# Altium project ESP32-DCU-Rev1.PrjPcb (part 2 of 2)

## Sheet TCA9548A.SchDoc
size B
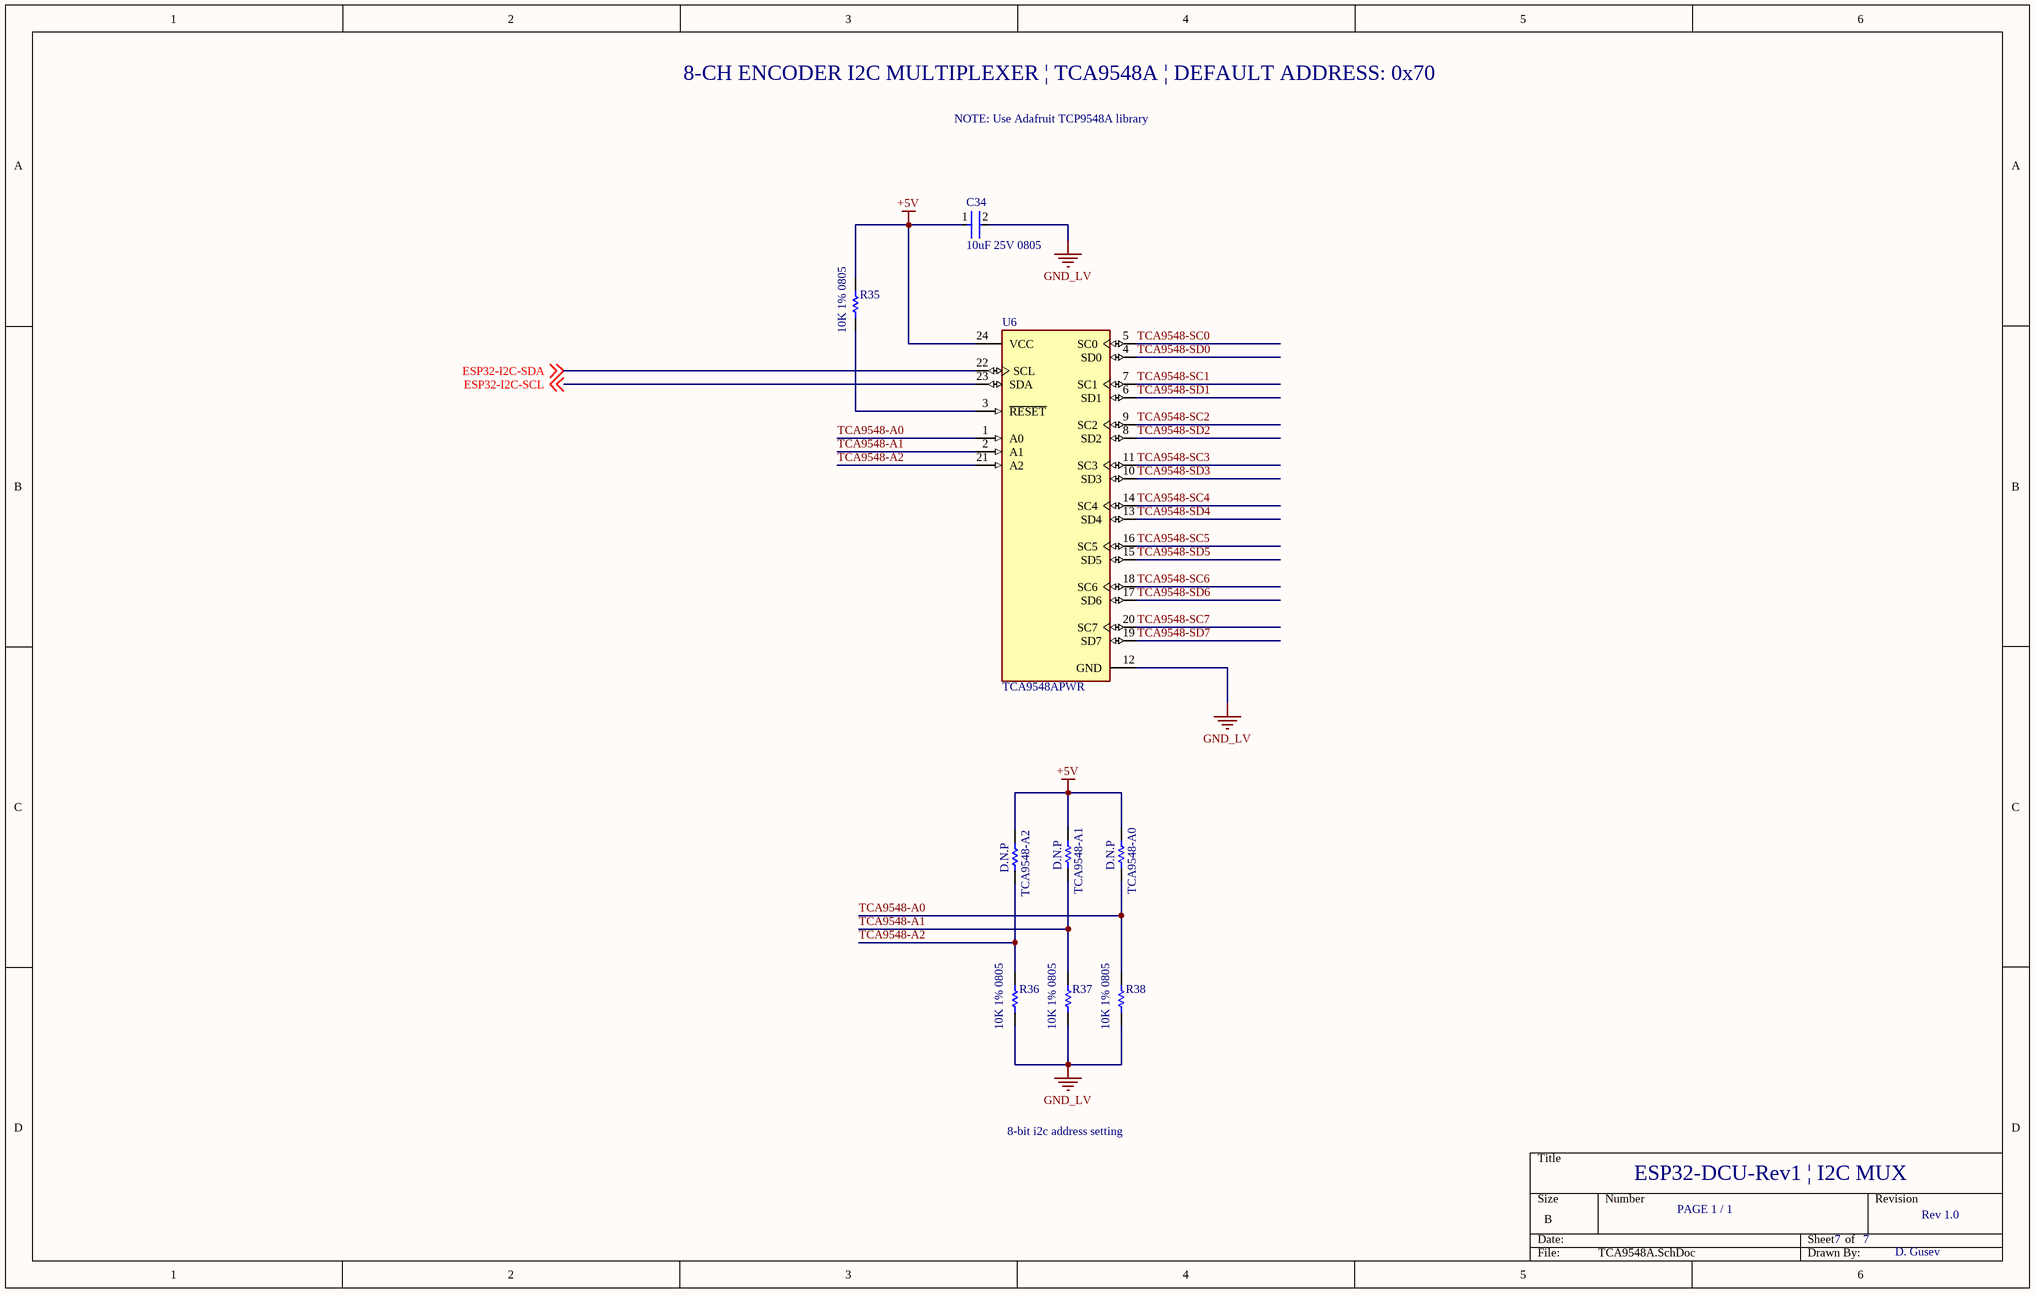
[diagram p5: TCA9548A.SchDoc]

### Parts
C34  10uF 25V 0805  [FP-GRM21B-0_15-IPC_B]
R35  10K 1% 0805  [RESC2013X60X35ML10T20]
R36  10K 1% 0805  [RESC2013X60X35ML10T20]
R37  10K 1% 0805  [RESC2013X60X35ML10T20]
R38  10K 1% 0805  [RESC2013X60X35ML10T20]
TCA9548-A0  D.N.P  [RESC2013X60X35LL10T20]
TCA9548-A1  D.N.P  [RESC2013X60X35LL10T20]
TCA9548-A2  D.N.P  [RESC2013X60X35LL10T20]
U6  TCA9548APWR  [FP-PW0024A-MFG]

### Nets
+5V: C34.1 R35.2 TCA9548-A0.2 TCA9548-A1.2 TCA9548-A2.2 U6.24(VCC)
GND_LV: C34.2 R36.2 R37.2 R38.2 U6.12(GND)
ESP32-I2C-SCL: U6.23(SDA) ; off-sheet ESP32-I2C-SCL  [project net GPIO22 / SCL]
ESP32-I2C-SDA: U6.22(SCL) ; off-sheet ESP32-I2C-SDA  [project net GPIO21 / SDA]
TCA9548-A0: R38.1 TCA9548-A0.1 U6.1(A0)
TCA9548-A1: R37.1 TCA9548-A1.1 U6.2(A1)
TCA9548-A2: R36.1 TCA9548-A2.1 U6.21(A2)
TCA9548-SC0: U6.5(SC0)
TCA9548-SC1: U6.7(SC1)
TCA9548-SC2: U6.9(SC2)
TCA9548-SC3: U6.11(SC3)
TCA9548-SC4: U6.14(SC4)
TCA9548-SC5: U6.16(SC5)
TCA9548-SC6: U6.18(SC6)
TCA9548-SC7: U6.20(SC7)
TCA9548-SD0: U6.4(SD0)
TCA9548-SD1: U6.6(SD1)
TCA9548-SD2: U6.8(SD2)
TCA9548-SD3: U6.10(SD3)
TCA9548-SD4: U6.13(SD4)
TCA9548-SD5: U6.15(SD5)
TCA9548-SD6: U6.17(SD6)
TCA9548-SD7: U6.19(SD7)
NetR35_1: R35.1 U6.3(~{RESET})

### Notes on the sheet
- 8-CH ENCODER I2C MULTIPLEXER | TCA9548A | DEFAULT ADDRESS: 0x70
- NOTE: Use Adafruit TCP9548A library
- 8-bit i2c address setting
- ESP32-DCU-Rev1 | I2C MUX
- PAGE 1 / 1
- 7
- Rev 1.0
- D. Gusev

### Library data of the parts
C34 = CMP-2007-03541-2: Chip Multilayer Ceramic Capacitors for General Purpose, 0805, 10uF, X5R, 15%, 10%, 25V; Length: 2mm; Depth: 1.25mm; Termination: SMD/SMT; Voltage: 25V; Height: 1.25mm; Material: Ceramic; Thickness: 0.053inch; Radiation Hardening: No; Min Operating Temperature: -55°C; Width: 0.049inch; Package Quantity: 1; Mount: Surface Mount; Dielectric: X5R; Packaging: Tape and Reel; Capacitance: 10uF; Voltage Rating (DC): 25V; Lead Free: Lead Free; Max Operating Temperature: 85°C; Case Code (Imperial): 0805; Case/Package: 0805; Tolerance: 10%; Voltage Rating: 25V; Case Code (Metric): 2012
R35-R38 = CMP-2000-05025-1: Chip Resistor, 10 KOhm, +/- 5%, 0.125 W, -55 to 155 degC, 0805 (2012 Metric), RoHS, Tape and Reel; Manufacturer: Yageo; Resistor Element Type: ThickFilm; Voltage Rating: 150V; Product Range: RCSeries; SVHC: ToBeAdvised; Resistor Case Style: 0805[2012Metric]; Temperature Coefficient: ±100ppm/degC; Power Rating: 250mW; Resistance: 10kohm; Automotive Qualification Standard: -; Datasheet Version: REV. 2, 09/2004; Packaging: CutTape; Resistance Tolerance: ±5%; MSL: MSL1-Unlimited; Manufacturer URL: http://www.yageo.com/; Datasheet URL: http://www.yageo.ru/pdf/RC0805.pdf; Package Description: 2-Pin Surface Mounted Device, Body 2 x 1.25 mm; Package Reference: 805
TCA9548-A0-TCA9548-A2 = CMP-1659-00014-4: as VSPI-CS-5 on sheet ESP32; REACH SVHC: No SVHC; Mounting Technology: Surface Mount; RoHSCompliant: true; Packaging: Tape and Reel; ComponentLink2URL: http://www.yageo.com/documents/recent/PYu-RC_Group_51_RoHS_L_04.pdf; Pins: 2; Package Quantity: 5000; DatasheetVersion: Rev. 4, 02/2016; Mount: Surface Mount; Max Operating Temperature: 155 degC; PackageDescription: 2-Pin Surface Mounted Device, Body 2 x 1.25 mm; PackageReference: 0805; Length: 2 mm; Min Operating Temperature: -55 degC; ComponentLink1URL: http://www.yageo.com/; Height: 0.5 mm; ComponentLink1Description: Manufacturer URL; ComponentLink2Description: Datasheet
U6 = CMP-04892-000002-1: IC I2C SW 8CH W/RESET 24TSSOP; Manufacturer: Texas Instruments; Number Of Circuits: 1; Mux Demux Ratio: 1:8; Nominal Supply Current: 2-50uA; Interface: I2C,SMBus; Min Supply Voltage: 1.65V; Standoff Height: 0.05mm; Description: Bus Switch 1 x 8:1 24-TSSOP; Max Supply Voltage: 5.5V; Device Class L2: Interface ICs; ComponentLink2Description: Datasheet; Ipc Land Pattern Name: SOP65P640X120-24; Category: IC; Device Class L1: Integrated Circuits (ICs); Manufacturer Part Number: TCA9548APWR; RoHS: TRUE; Temperature Range High: +85°C; Digikey Description: IC I2C SW 8CH W/RESET 24TSSOP; Temperature Range Low: -40°C; Lead Free: Yes; Package: PW0024A; ComponentLink2URL: http://www.ti.com/lit/ds/symlink/tca9548a.pdf; Device Class L3: Multiplexers; Ambient Temperature Range Low: -40°C; Mouser Description: Low-Voltage 8-Channel I2C Switch With Reset 24-TSSOP -40 to 85; Temperature: -40°C to +85°C; Octopart: https://octopart.com/tca9548apwr-texas+instruments-22266789; Ambient Temperature Range High: +85°C; Automotive: No; Height: 1.2mm

## Sheet DCU1.SchDoc
size B
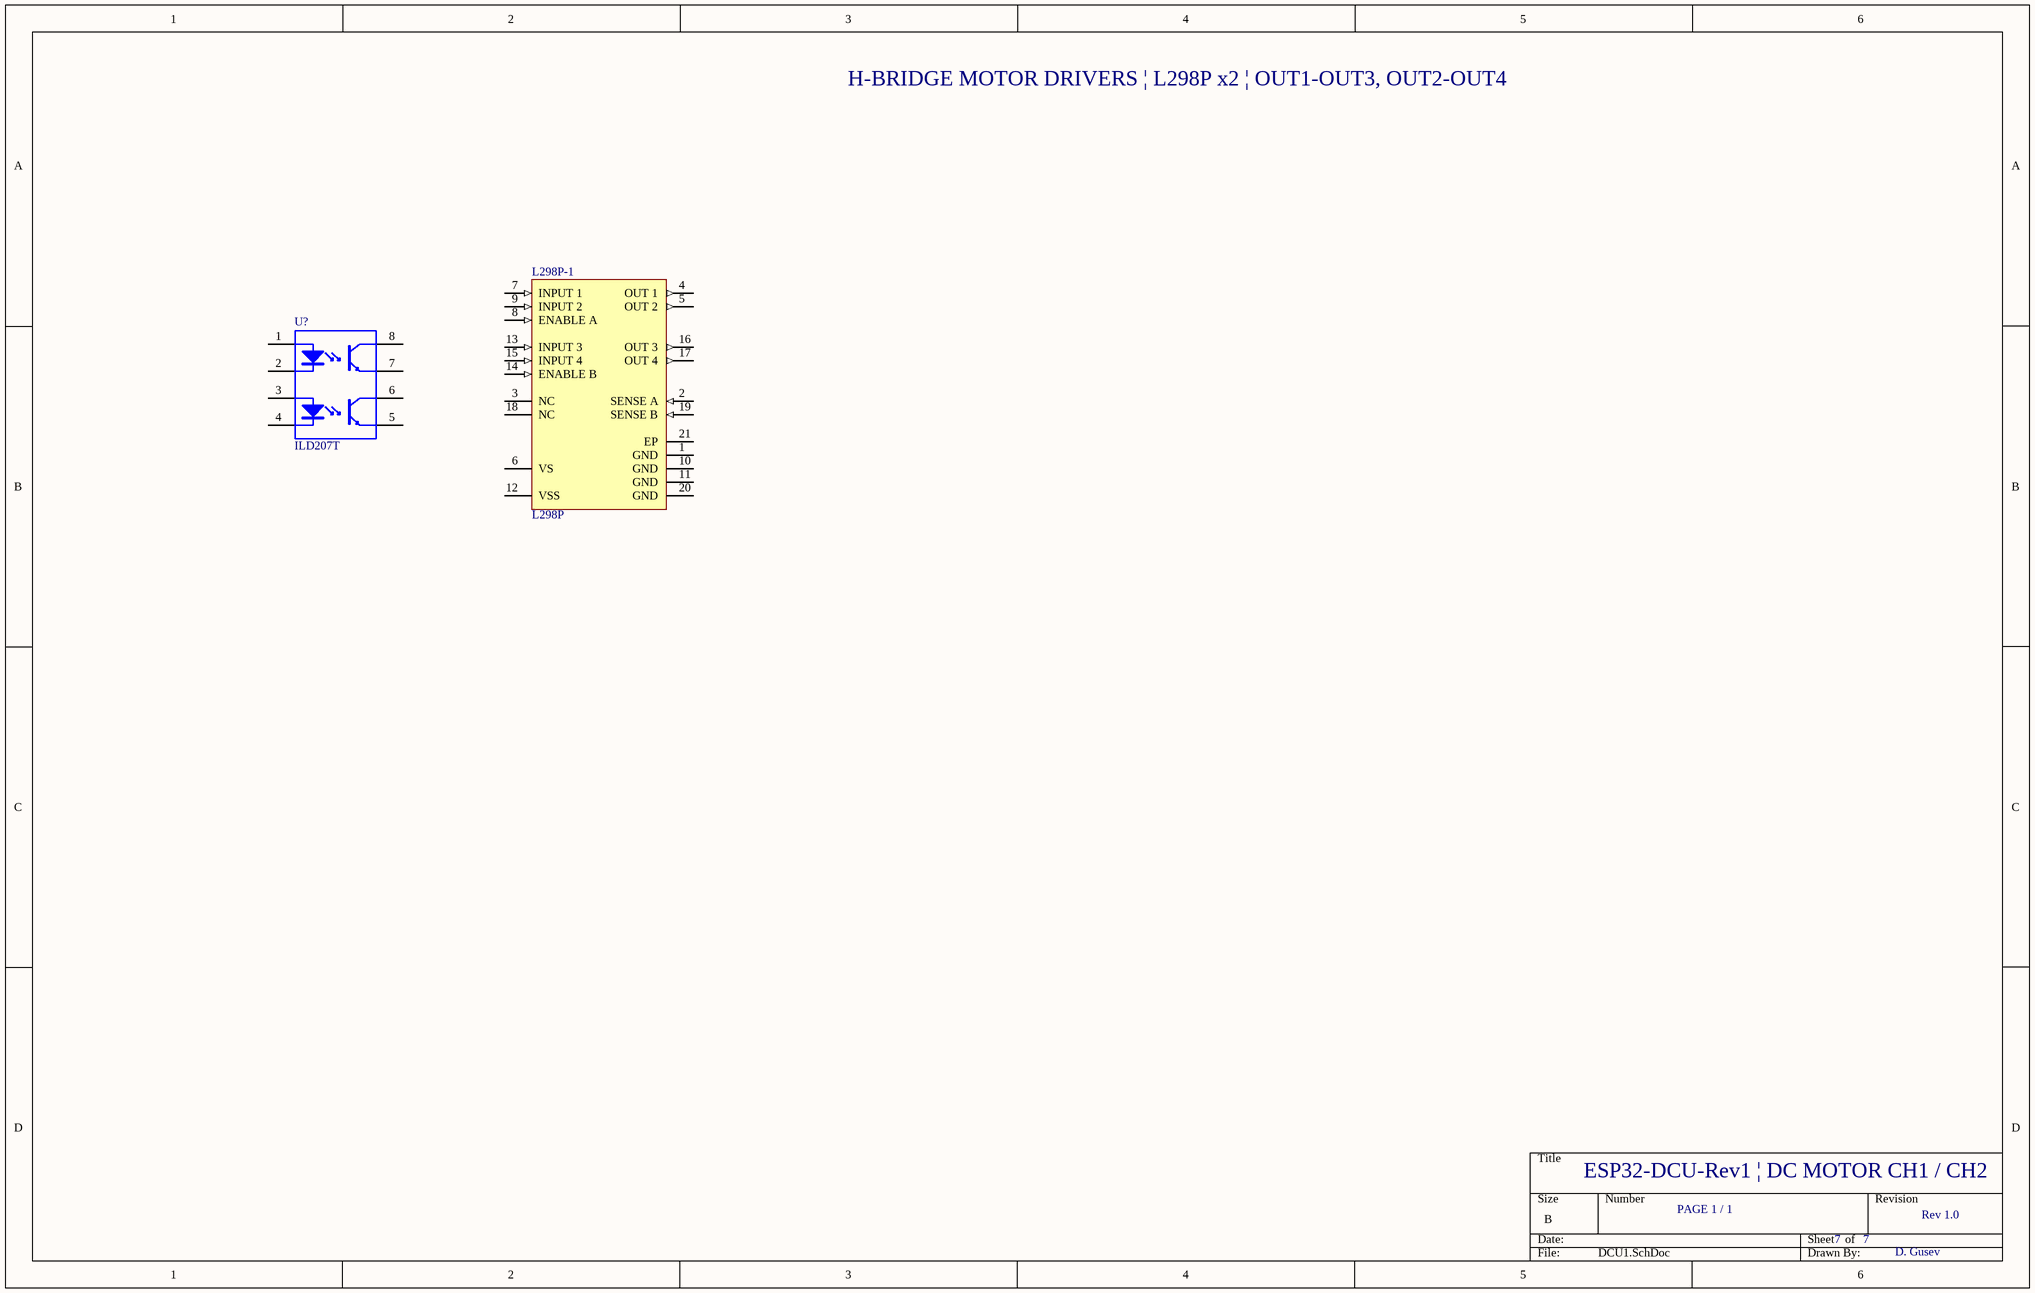
[diagram p6: DCU1.SchDoc]

### Parts
L298P-1  L298P  [STM-PowerSO20_M]
U?  ILD207T  [VISH-SOIC-8_C_V]

### Nets

Not connected (* = marked no-connect by the designer): L298P-1 1(GND) 2(SENSE_A) 3(NC) 4(OUT_1) 5(OUT_2) 6(VS) 7(INPUT_1) 8(ENABLE_A) 9(INPUT_2) 10(GND) 11(GND) 12(VSS) 13(INPUT_3) 14(ENABLE_B) 15(INPUT_4) 16(OUT_3) 17(OUT_4) 18(NC) 19(SENSE_B) 20(GND) 21(EP); U? 1(A) 2(K) 3(A) 4(K) 5(E) 6(C) 7(E) 8(C)

### Notes on the sheet
- H-BRIDGE MOTOR DRIVERS | L298P x2 | OUT1-OUT3, OUT2-OUT4
- ESP32-DCU-Rev1 | DC MOTOR CH1 / CH2
- PAGE 1 / 1
- 7
- Rev 1.0
- D. Gusev

### Library data of the parts
L298P-1 = CMP-2100-03649-1: Dual Full-Bridge Driver, 4.5 to 7 V, -25 to 130 degC, 20-Pin SOIC, RoHS, Tube; Manufacturer: STMicroelectronics; Output Current: 2A; Collector Emitter Voltage (VCEO): 46V; Min Supply Voltage: 4.8V; Max Collector Current: 3A; Supply Voltage: 42V; Number of Channels: 2; Operating Supply Current: 13mA; Packaging: Rail/Tube; Package Reference: PowerSO20; Width: 11.1mm; Radiation Hardening: No; Height: 3.3mm; Lead Free: LeadFree; Datasheet Version: 36526.0; Datasheet URL: http://www.st.com/content/ccc/resource/technical/document/datasheet/82/cc/3f/39/0a/29/4d/f0/CD00000240.pdf/files/CD00000240.pdf/jcr:content/translations/en.CD00000240.pdf; RoHSCompliant: true; Max Supply Voltage: 46V; Output Current per Channel: 2A; Package Description: 20-Pin Small Outline Integrated Circuits, Body 15.9 x 11 mm, Pitch 1.27 mm; Case/Package: SOIC; Min Operating Temperature: -25degC; Number of Pins: 20; Length: 16mm; Max Output Current: 3A; Package Quantity: 31; Max Operating Temperature: 130degC; Mount: SurfaceMount; Manufacturer URL: http://www.st.com/
U? = CMP-2000-06453-1: Optocoupler, Phototransistor Output, Dual Channel, 4000 VRMS, -55 to 100 degC, 8-Pin SOIC, RoHS, Tape and Reel; Manufacturer: Vishay; Voltage - Output (Max): 70V; Vce Saturation (Max): 400mV; Number of Channels: 2; Voltage - Forward (Vf) (Typ): 1.2V; EDA / CAD Models: DownloadfromAcceleratedDesigns; Current Transfer Ratio (Min): 100%@10mA; Current Transfer Ratio (Max): 200%@10mA; Input Type: DC; Current - DC Forward (If) (Max): 30mA; Rise / Fall Time (Typ): 3µs,4.7µs; Turn On / Turn Off Time (Typ): 6µs,5µs; Catalog Drawings: OptocouplerCircuit; Other Names: 751-1310-1ILD207TGICTILD207TGICT-ND; Online Catalog: ILD205T,206T,207T,211T,213T,217TSeries; Mounting Type: SurfaceMount; Package Description: 8-Pin Small Outline Integrated Circuit, Body 5.84 x 3.91 mm, Pitch 1.27 mm; Output Type: Transistor; Package / Case: 8-SOIC(0.154",3.90mmWidth); Category: Isolators; Operating Temperature: -55°C~100°C; Family: Optoisolators-Transistor,PhotovoltaicOutput; Package Reference: SOIC-8; Voltage - Isolation: 4000Vrms; Supplier Device Package: 8-SOIC; Standard Package: 1; Manufacturer URL: http://www.vishay.com/; Series: -; Packaging: CutTape(CT); Datasheet Version: Rev. 2.1, 10/2015; Datasheet URL: http://www.vishay.com/docs/83647/ild205t.pdf; Mounting Technology: SurfaceMount; Current - Output / Channel: -

## Sheet RELAYS.SchDoc
size B
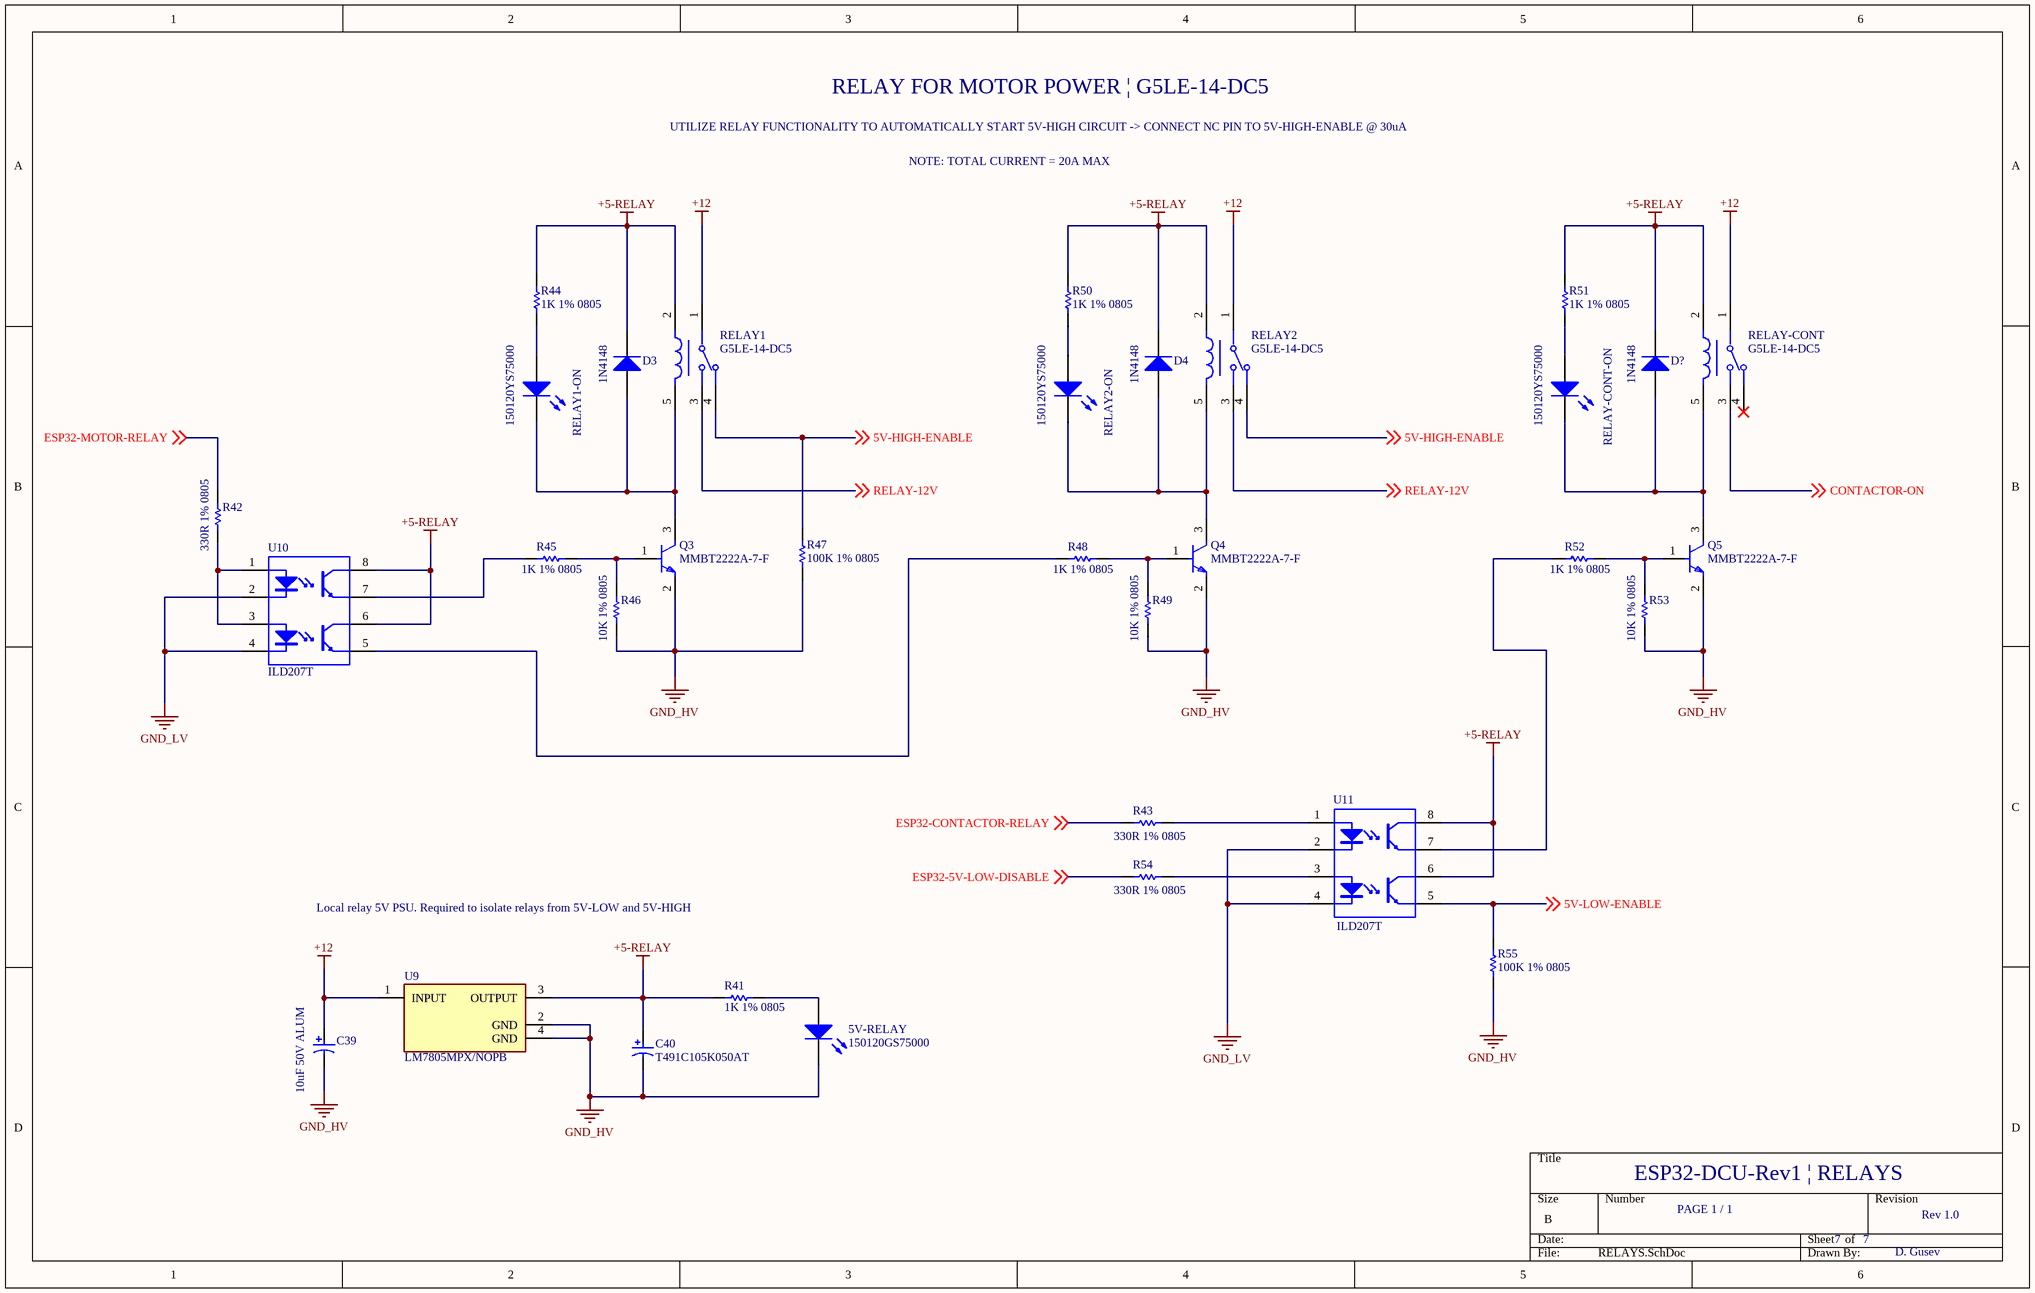
[diagram p7: RELAYS.SchDoc]

### Parts
5V-RELAY  150120GS75000  [1206_A]
C39  10uF 50V ALUM  [PNSC-FK-V-D_V]
C40  T491C105K050AT  [KEMT-T491-C_L]
D3  1N4148  [NXP-SOD27-2_V]
D4  1N4148  [NXP-SOD27-2_V]
D?  1N4148  [NXP-SOD27-2_V]
Q3  MMBT2222A-7-F  [FP-SOT23-IPC_A]
Q4  MMBT2222A-7-F  [FP-SOT23-IPC_A]
Q5  MMBT2222A-7-F  [FP-SOT23-IPC_A]
R41  1K 1% 0805  [RESC2013X60X40ML20T25]
R42  330R 1% 0805  [RESC2013X60X35LL10T20]
R43  330R 1% 0805  [RESC2013X60X35LL10T20]
R44  1K 1% 0805  [RESC2013X60X35ML10T20]
R45  1K 1% 0805  [RESC2013X60X35ML10T20]
R46  10K 1% 0805  [RESC2013X60X35NL10T20]
R47  100K 1% 0805  [RESC2013X60X35ML10T20]
R48  1K 1% 0805  [RESC2013X60X35ML10T20]
R49  10K 1% 0805  [RESC2013X60X35NL10T20]
R50  1K 1% 0805  [RESC2013X60X35ML10T20]
R51  1K 1% 0805  [RESC2013X60X35ML10T20]
R52  1K 1% 0805  [RESC2013X60X35ML10T20]
R53  10K 1% 0805  [RESC2013X60X35NL10T20]
R54  330R 1% 0805  [RESC2013X60X35LL10T20]
R55  100K 1% 0805  [RESC2013X60X35ML10T20]
RELAY1  G5LE-14-DC5  [FP-G5LE-14-DC5-MFG]
RELAY1-ON  150120YS75000  [1206_A]
RELAY2  G5LE-14-DC5  [FP-G5LE-14-DC5-MFG]
RELAY2-ON  150120YS75000  [1206_A]
RELAY-CONT  G5LE-14-DC5  [FP-G5LE-14-DC5-MFG]
RELAY-CONT-ON  150120YS75000  [1206_A]
U9  LM7805MPX/NOPB  [FP-LM7805MPX-NOPB-MFG]
U10  ILD207T  [VISH-SOIC-8_C_V]
U11  ILD207T  [VISH-SOIC-8_C_V]

### Nets
+5-RELAY: C40.1 D3.2(K) D4.2(K) D?.2(K) R41.1 R44.1 R50.1 R51.1 RELAY1.2 RELAY2.2 RELAY-CONT.2 U9.3(OUTPUT) U10.6(C) U10.8(C) U11.6(C) U11.8(C)
+12: C39.1 RELAY1.1 RELAY2.1 RELAY-CONT.1 U9.1(INPUT)
GND_HV: 5V-RELAY.1(K) C39.2 C40.2 Q3.2(E) Q4.2(E) Q5.2(E) R46.1 R47.1 R49.1 R53.1 R55.1 U9.2(GND) U9.4(GND)
GND_LV: U10.2(K) U10.4(K) U11.2(K) U11.4(K)
5V-HIGH-ENABLE: R47.2 RELAY1.4 RELAY2.4 ; off-sheet 5V-HIGH-ENABLE
5V-LOW-ENABLE: R55.2 U11.5(E) ; off-sheet 5V-LOW-ENABLE
CONTACTOR-ON: RELAY-CONT.3 ; off-sheet CONTACTOR-ON
ESP32-5V-LOW-DISABLE: R54.1 ; off-sheet ESP32-5V-LOW-DISABLE
ESP32-CONTACTOR-RELAY: R43.1 ; off-sheet ESP32-CONTACTOR-RELAY
ESP32-MOTOR-RELAY: R42.1 ; off-sheet ESP32-MOTOR-RELAY
RELAY-12V: RELAY1.3 RELAY2.3 ; off-sheet RELAY-12V
Net5V-RELAY_2: 5V-RELAY.2(A) R41.2
NetD3_1: D3.1(A) Q3.3(C) RELAY1.5 RELAY1-ON.1(K)
NetD4_1: D4.1(A) Q4.3(C) RELAY2.5 RELAY2-ON.1(K)
NetD?_1: D?.1(A) Q5.3(C) RELAY-CONT.5 RELAY-CONT-ON.1(K)
NetQ3_1: Q3.1(B) R45.2 R46.2
NetQ4_1: Q4.1(B) R48.2 R49.2
NetQ5_1: Q5.1(B) R52.2 R53.2
NetR42_2: R42.2 U10.1(A) U10.3(A)
NetR43_2: R43.2 U11.1(A)
NetR44_2: R44.2 RELAY1-ON.2(A)
NetR45_1: R45.1 U10.7(E)
NetR48_1: R48.1 U10.5(E)
NetR50_2: R50.2 RELAY2-ON.2(A)
NetR51_2: R51.2 RELAY-CONT-ON.2(A)
NetR52_1: R52.1 U11.7(E)
NetR54_2: R54.2 U11.3(A)

Not connected (* = marked no-connect by the designer): RELAY-CONT 4*

### Notes on the sheet
- RELAY FOR MOTOR POWER | G5LE-14-DC5
- UTILIZE RELAY FUNCTIONALITY TO AUTOMATICALLY START 5V-HIGH CIRCUIT -> CONNECT NC PIN TO 5V-HIGH-ENABLE @ 30uA
- NOTE: TOTAL CURRENT = 20A MAX
- Local relay 5V PSU. Required to isolate relays from 5V-LOW and 5V-HIGH
- ESP32-DCU-Rev1 | RELAYS
- PAGE 1 / 1
- 7
- Rev 1.0
- D. Gusev

### Library data of the parts
5V-RELAY = CMP-1426-00014-1: SMD mono-color Chip LED, WL-SMCW, Green; Manufacturer: Wuerth Elektronik; PackageReference: 1206_A; PartNumber: 150120GS75000; ComponentLink1Description: Manufacturer URL; ComponentLink2URL: http://katalog.we-online.com/led/datasheet/150120GS75000.pdf; ComponentLink2Description: Datasheet; Color: Green; ComponentLink1URL: http://www.we-online.com
C39 = CMP-2000-06207-1: Aluminum Electrolytic Capacitor, 10 uF, +/- 20%, 50 V, 2-Pin SMD (Size Code D), -55 to 105 degC, RoHS, Tape and Reel; Manufacturer: Panasonic; Lifetime@Temperature: 2000Hrs@105°C; Type: Can; Ripple Current: 165mA; Impedance: 0.88O; Capacitance: 10µF; Manufacturer URL: http://www.panasonic.com/; Mounting Technology: SurfaceMount; Rated Voltage: 50V; Datasheet URL: http://industrial.panasonic.com/cdbs/www-data/pdf/RDE0000/ABA0000C1181.pdf; Package Reference: FK-V-D; Series: FK; Operating Temp Range: -55to+105°C; Operating Temp-Max: 105°C; Datasheet Version: 03/2016; Package URL: http://industrial.panasonic.com/cdbs/www-data/pdf/RDE0000/DME0000COL48.pdf; Case Size/Dimension: Ø6.3x5.8mm; Package Description: 2-Pin Electrolytic Aluminum Capacitor, Body 6.6 x 6.6 mm
C40 = CMP-2000-07195-1: Tantalum Capacitor, 1 uF, +/- 10%, 50 V, -55 to 125 degC, 2-Pin SMD, RoHS, Tape and Reel; Manufacturer: Kemet; Capacitance: 1000000pF; Rad Hardened: No; Case Style: Molded; Product Diameter (mm): NotRequiredmm; Seal: NotRequired; DF: 4%; ESR: 5.5ohm; DCL: 0.5uA; Product Length (mm): 6mm; Product Height (mm): 2.5mm; Polarity: Polar; Voltage: 50VDC; Product Depth (mm): 3.2mm; Operating Temp Range: -55Cto125C; Package Description: 2-Pin Surface Mount Device, Body 6 x 3.2 mm; Failure Rate: NotRequired; Seated Plane Height: NotRequiredmm; Lead Spacing (nom): NotRequiredmm; Packaging: TapeandReel; Case Code: C; Length W/Weld: NotRequiredmm; Tolerance (+ or -): 10%; Datasheet URL: http://capacitoredge.kemet.com/capedge2/DataSheet/Datasheet-T491C105K050AT.pdf?pn=T491C105K050AT; Datasheet Version: 10/2016; Manufacturer URL: http://www.kemet.com/; Wire Form: NotRequired; Package / Case: 6032-28; Mounting Technology: SurfaceMount; Construction: SMTChip; Package Reference: T491-C; Length W/Weld (max): NotRequiredmm; Insulation: NotRequired; Mounting Style: SurfaceMount
D3 D4 D? = CMP-0648-00002-1: High-speed Diode, 100 V, 450 mA, 2-Pin SOD27, RoHS; Manufacturer: NXP Semiconductors; Configuration: Single; IR (VR: 20 V)=25 nA; IFRM: 450 mA; IFSM: 4 A Max.; Trr: 4 ns Max.; Cd: 4 pF Max.; VR: 100 V Max.; VF (IF: 10 mA)=1 V; IF: 200 mA Max.; ComponentLink1Description: Manufacturer URL; RoHS: TRUE; ComponentLink1URL: http://www.nxp.com/; ComponentLink3Description: Package Specification; DatasheetVersion: Aug-04; ComponentLink2Description: Datasheet; PackageVersion: Aug-04; PackageReference: SOD27; ComponentLink3URL: http://www.nxp.com/documents/data_sheet/1N4148_1N4448.pdf; Mounting Technology: Through Hole; ComponentLink2URL: http://www.nxp.com/documents/data_sheet/1N4148_1N4448.pdf; PartNumber: 1N4148; PackageDescription: 2-Pin Hermetically Sealed Glass Package, Axial Leaded, Dia 1.85 mm, Body Length 4.25 mm, Lead Spread 25.4 mm
Q3-Q5 = CMP-12798-000050-1: TRANS NPN 40V 0.6A SMD SOT23-3; Number of Elements: 1; Frequency: 300MHz; Max Collector Current: 600mA; Collector Base Voltage (VCBO): 75V; Current: 1A; Element Configuration: Single; Power Dissipation: 350mW; hFE Min: 100; Collector Emitter Saturation Voltage: 1V; Max Power Dissipation: 300mW; Emitter Base Voltage (VEBO): 6V; Voltage: 40V; Collector Emitter Breakdown Voltage: 40V; Width: 1.4mm; Polarity: NPN; Termination: SMD/SMT; Max Operating Temperature: 150°C; Transition Frequency: 300MHz; Contact Plating: Tin; Mount: Surface Mount; Max Frequency: 300MHz; Case/Package: SOT-23; Gain Bandwidth Product: 300MHz; Lead Free: Lead Free; Collector Emitter Voltage (VCEO): 40V; Radiation Hardening: No; Voltage Rating (DC): 40V; Height: 1mm; Max Breakdown Voltage: 40V; Packaging: Tape and Reel; Length: 3.05mm; Min Operating Temperature: -55°C; Weight: 0.000282oz; Current Rating: 600mA; REACH SVHC: No SVHC; Package Quantity: 3000; Continuous Collector Current: 600mA; Number of Pins: 3
R41 = CMP-2001-00590-1: Part Number: ERA6AEB123V; Manufacturer: Panasonic
R42 R43 R54 = CMP-2000-06960-1: Chip Resistor, 330 Ohm, +/- 1%, 125 mW, -55 to 155 degC, 0805 (2012 Metric), RoHS, Tape and Reel; Manufacturer: Yageo; Voltage Rating: 150V; Temperature Coefficient: 100PPM/C; Power Rating: 125mW(1/8W); Resistance: 330Ohms; Datasheet Version: Rev. 7, 05/2017; Termination Style: SMD/SMT; Case Code - mm: 2012; Package Description: 2-Pin Surface Mounted Device, Body 2 x 1.25 mm; Operating Temperature Range: -55Cto+155C; Case Code - in: 0805; Packaging: Reel; Tolerance: 1%; Package Reference: 0805; Mounting Technology: SurfaceMount; Product: ThickFilmResistorsGeneralPurpose; Series: RC; Manufacturer URL: http://www.yageo.com/; Datasheet URL: http://www.yageo.com/documents/recent/PYu-RC_Group_51_RoHS_L_7.pdf
R44 R45 R48 R50-R52 = CMP-2100-03671-1: Chip Resistor, 1 KOhm, +/- 1%, 125 mW, -55 to 155 degC, 0805 (2012 Metric), RoHS, Tape and Reel; Manufacturer: Yageo; Temperature Coefficient: 100ppm/degreesC; Voltage Rating (DC): 150V; Max Power Dissipation: 125mW; Resistance: 1KOhm; Number of Pins: 2; Number of Terminations: 2; Datasheet URL: http://www.yageo.com/NewPortal/yageodocoutput?fileName=/pdf/R-Chip/PYu-RC_Group_51_RoHS_L_5.pdf; Length: 0.079inch; Package Description: 2-Pin Surface Mounted Device, Body 2 x 1.25 mm; Depth: 1.25mm; Height: 0.024inch; Military Standard: Not; Case/Package: 0805; Package Reference: 0805; RoHSCompliant: true; Lead Free: LeadFree; Packaging: TapeandReel; Package Quantity: 1; Datasheet Version: Rev. 5, 10/2016; Tolerance: 1%; Min Operating Temperature: -55degC; Voltage Rating: 150V; Composition: ThickFilm; Case Code (Imperial): 0805; Power Rating: 125mW; Width: 0.049inch; Case Code (Metric): 2012; Manufacturer URL: http://www.yageo.com/; Max Operating Temperature: 155degC; REACH SVHC: Unknown; Termination: SMD/SMT
R46 R49 R53 = CMP-1659-00013-4: Chip Resistor, 10 KOhm, +/- 1%, 0.125 W, -55 to 155 degC, 0805 (2012 Metric), RoHS, Tape and Reel; Manufacturer: Yageo; Voltage Rating: 150 V; Mount: Surface Mount; ComponentLink1Description: Manufacturer URL; ComponentLink2URL: http://www.yageo.com/documents/recent/PYu-RC_Group_51_RoHS_L_04.pdf; Pins: 2; Length: 2 mm; Min Operating Temperature: -55 degC; Height: 0.5 mm; Mounting Technology: Surface Mount; RoHSCompliant: true; REACH SVHC: No SVHC; ComponentLink1URL: http://www.yageo.com/; Max Operating Temperature: 155 degC; PackageReference: 0805; DatasheetVersion: Rev. 4, 02/2016; Package Quantity: 5000; Packaging: Tape and Reel; ComponentLink2Description: Datasheet; PackageDescription: 2-Pin Surface Mounted Device, Body 2 x 1.25 mm
R47 R55 = CMP-2100-03668-1: Chip Resistor, 100 KOhm, +/- 1%, 0.125 W, -55 to 155 degC, 0805 (2012 Metric), RoHS, Tape and Reel; Manufacturer: Yageo; Max Power Dissipation: 125mW; Voltage Rating: 150V; Temperature Coefficient: 100ppm/degreesC; Manufacturer URL: http://www.yageo.com/; Min Operating Temperature: -55degC; Lead Pitch: 0.4mm; Composition: ThickFilm; Case Code (Metric): 2012; Military Standard: Not; Package Description: 2-Pin Surface Mounted Device, Body 2 x 1.25 mm; REACH SVHC: Unknown; RoHSCompliant: true; Depth: 1.25mm; Number of Pins: 2; Lead Free: LeadFree; Resistance: 100KOhm; Datasheet URL: http://www.yageo.com/NewPortal/yageodocoutput?fileName=/pdf/R-Chip/PYu-RC_Group_51_RoHS_L_5.pdf; Max Operating Temperature: 155degC; Case/Package: 0805; Package Quantity: 1; Case Code (Imperial): 0805; Power Rating: 125mW; Width: 0.049inch; Package Reference: 0805; Height: 0.024inch; Termination: SMD/SMT; Tolerance: 1%; Datasheet Version: Rev. 5, 10/2016; Length: 2mm; Voltage Rating (DC): 150V; Number of Terminations: 2; Packaging: TapeandReel
RELAY1 RELAY2 RELAY-CONT = CMP-08822-000008-1: RELAY GEN PURPOSE SPDT 10A 5V; Manufacturer: Omron; Number Of Contacts: 1; Coil Type: Non-Latching; Coil Current: 79.4mA; Coil Power: 400mW; Coil Resistance: 63Ω; Standoff Height: 0.5mm; Throw Configuration: SPDT; Ambient Temperature Range Low: -25°C; Package: 0; Device Class L2: Relays; Temperature Range High: +85°C; ComponentLink2Description: Datasheet; Octopart: https://octopart.com/g5le-14-dc5-omron-28829; Coil Voltage: 5V; Lead Free: Yes; Digikey Description: RELAY GEN PURPOSE SPDT 10A 5V; Device Class L1: Electromechanical; Device Class L3: Power Relays; ComponentLink2URL: https://omronfs.omron.com/en_US/ecb/products/pdf/en-g5le.pdf; Temperature: -25°C to +85°C; Ambient Temperature Range High: +85°C; RoHS: TRUE; Automotive: No; Height: 19mm; Category: Relay; Manufacturer Part Number: G5LE-14-DC5; Mouser Description: General Purpose Relays Power PCB Relay SPDT Sealed 5VDC; Current Rating: 10A; Switching Current: 10A; Temperature Range Low: -25°C
RELAY1-ON RELAY2-ON RELAY-CONT-ON = CMP-1426-00019-1: SMD mono-color Chip LED, WL-SMCW, Yellow; Manufacturer: Wuerth Elektronik; ComponentLink2URL: http://katalog.we-online.com/led/datasheet/150120YS75000.pdf; PartNumber: 150120YS75000; ComponentLink1URL: http://www.we-online.com; Color: Yellow; ComponentLink1Description: Manufacturer URL; PackageReference: 1206_A; ComponentLink2Description: Datasheet
U9 = CMP-04917-000022-1: IC REG LINEAR 5V 1.5A SOT223-4; Manufacturer: Texas Instruments; Dropout Voltage: 2V; Output Type: Fixed; Accuracy Percentage: 3%; Description: Linear Voltage Regulator IC  1 Output  1.5A SOT-223-4; Nominal Supply Current: 8mA; Standoff Height: 0.02mm; Min Supply Voltage: 7.5V; Number Of Outputs: 1; Max Junction Temp: +150°C; Max Supply Voltage: 30V; Height: 1.8mm; Temperature Range High: +125°C; Device Class L3: Voltage Regulators - Linear; Lead Free: Yes; Digikey Description: IC REG LINEAR 5V 1.5A SOT223-4; Output Current: 1.5A; Manufacturer Part Number: LM7805MPX/NOPB; Automotive: No; Device Class L1: Integrated Circuits (ICs); ComponentLink2Description: Datasheet; Device Class L2: Power Management ICs; Category: IC; Octopart: https://octopart.com/lm7805mpx%2Fnopb-texas+instruments-74629992; Package: SOT223-4; RoHS: TRUE; Output Voltage: 5V; Temperature Range Low: 0°C; Temperature: 0°C to +125°C; ComponentLink2URL: http://www.ti.com/lit/ds/symlink/lm7800.pdf
U10 U11 = CMP-2000-06453-1: as U? on sheet DCU1; Mounting Type: SurfaceMount; Package Description: 8-Pin Small Outline Integrated Circuit, Body 5.84 x 3.91 mm, Pitch 1.27 mm; Output Type: Transistor; Package / Case: 8-SOIC(0.154",3.90mmWidth); Category: Isolators; Operating Temperature: -55°C~100°C; Family: Optoisolators-Transistor,PhotovoltaicOutput; Package Reference: SOIC-8; Voltage - Isolation: 4000Vrms; Supplier Device Package: 8-SOIC; Standard Package: 1; Manufacturer URL: http://www.vishay.com/; Series: -; Packaging: CutTape(CT); Datasheet Version: Rev. 2.1, 10/2015; Datasheet URL: http://www.vishay.com/docs/83647/ild205t.pdf; Mounting Technology: SurfaceMount; Current - Output / Channel: -

## Sheet POWER.SchDoc
size B
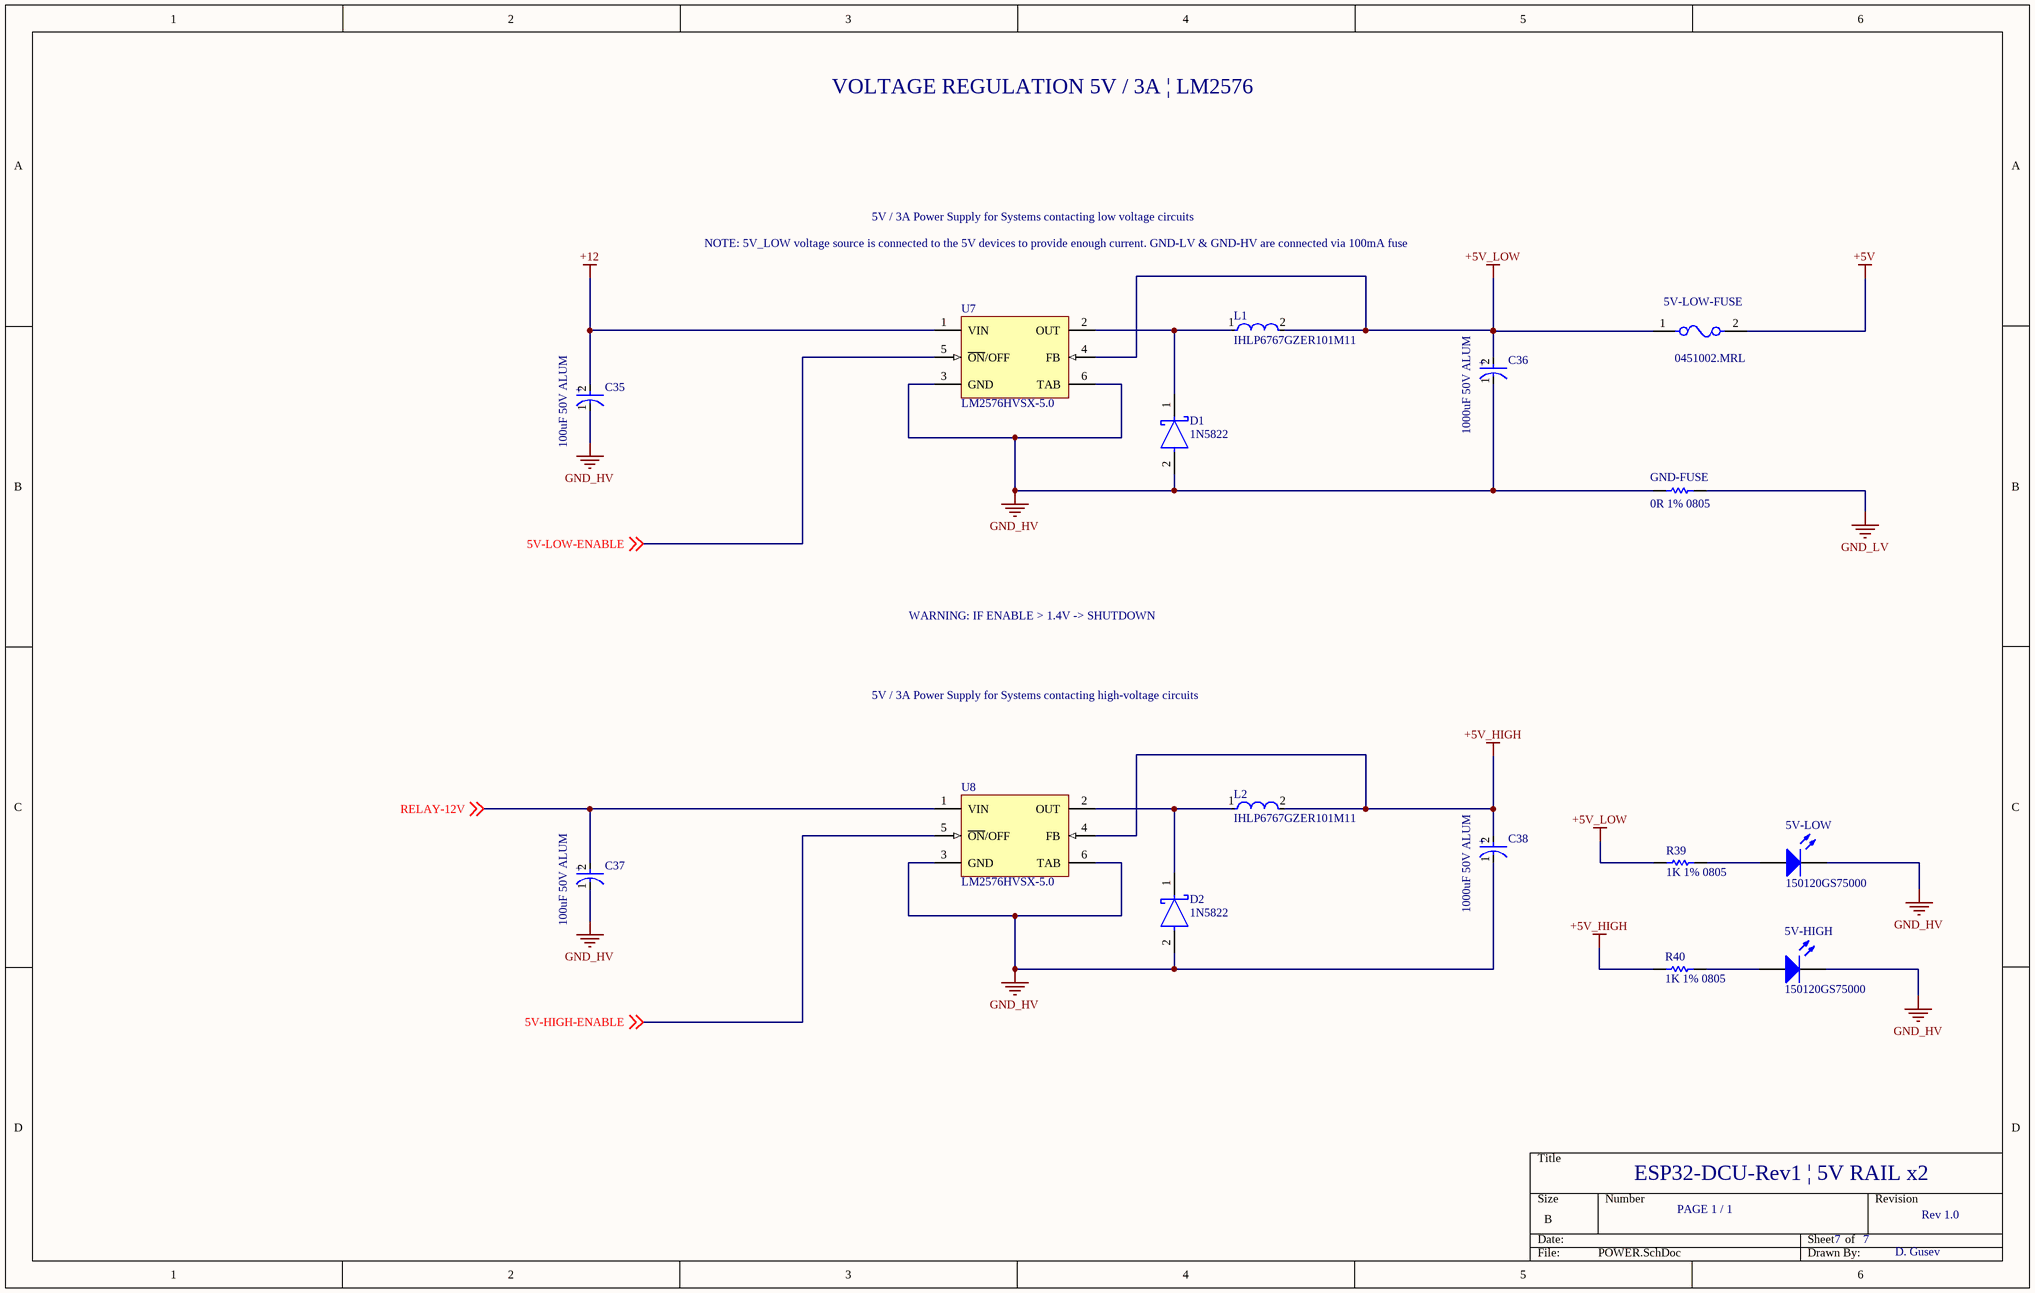
[diagram p8: POWER.SchDoc]

### Parts
(Parts that share a designator on the sheet are numbered #1, #2 ... from top to bottom, then left to right.)
5V-HIGH  150120GS75000  [1206_A]
5V-LOW  150120GS75000  [1206_A]
5V-LOW-FUSE  0451002.MRL  [FP-0451-MFG]
C35  100uF 50V ALUM  [FP-EEE-FK1H101P-MFG]
C36  1000uF 50V ALUM  [FP-FK-J16-MFG]
C37  100uF 50V ALUM  [FP-EEE-FK1H101P-MFG]
C38  1000uF 50V ALUM  [FP-FK-J16-MFG]
D1  1N5822  [FP-DO-201AD-MFG]
D2  1N5822  [FP-DO-201AD-MFG]
GND-FUSE  0R 1% 0805  [RESC2013X60X35ML10T20]
L1#2  IHLP6767GZER101M11  [FP-IHLP-6767GZ-FP_3_825x1-MFG]
L2  IHLP6767GZER101M11  [FP-IHLP-6767GZ-FP_3_825x1-MFG]
R39  1K 1% 0805  [RESC2013X60X40ML20T25]
R40  1K 1% 0805  [RESC2013X60X40ML20T25]
U7  LM2576HVSX-5.0  [KTT0005B_L]
U8  LM2576HVSX-5.0  [KTT0005B_L]

### Nets
+5V: 5V-LOW-FUSE.2
+5V_HIGH: C38.2(A) L2.2 R40.2 U8.4(FB)
+5V_LOW: 5V-LOW-FUSE.1 C36.2(A) L1#2.2 R39.2 U7.4(FB)
+12: C35.2(A) U7.1(VIN)
GND_HV: 5V-HIGH.1(K) 5V-LOW.1(K) C35.1(C) C36.1(C) C37.1(C) C38.1(C) D1.2(A) D2.2(A) GND-FUSE.1 U7.3(GND) U7.6(TAB) U8.3(GND) U8.6(TAB)
GND_LV: GND-FUSE.2
5V-HIGH-ENABLE: U8.5(~{ON}/OFF) ; off-sheet 5V-HIGH-ENABLE
5V-LOW-ENABLE: U7.5(~{ON}/OFF) ; off-sheet 5V-LOW-ENABLE
RELAY-12V: C37.2(A) U8.1(VIN) ; off-sheet RELAY-12V
Net5V-HIGH_2: 5V-HIGH.2(A) R40.1
Net5V-LOW_2: 5V-LOW.2(A) R39.1
NetD1_1: D1.1(C) L1#2.1 U7.2(OUT)
NetD2_1: D2.1(C) L2.1 U8.2(OUT)

### Notes on the sheet
- VOLTAGE REGULATION 5V / 3A | LM2576
- 5V / 3A Power Supply for Systems contacting low voltage circuits
- NOTE: 5V_LOW voltage source is connected to the 5V devices to provide enough current. GND-LV & GND-HV are connected via 100mA fuse
- WARNING: IF ENABLE > 1.4V -> SHUTDOWN
- 5V / 3A Power Supply for Systems contacting high-voltage circuits
- ESP32-DCU-Rev1 | 5V RAIL x2
- PAGE 1 / 1
- 7
- Rev 1.0
- D. Gusev
- (in symbol CMP-2000-06208-2) +
- (in symbol CMP-05427-000011-1) +

### Library data of the parts
5V-HIGH 5V-LOW = CMP-1426-00014-1: as 5V on sheet RELAYS; PackageReference: 1206_A; PartNumber: 150120GS75000; ComponentLink1Description: Manufacturer URL; ComponentLink2URL: http://katalog.we-online.com/led/datasheet/150120GS75000.pdf; ComponentLink2Description: Datasheet; Color: Green; ComponentLink1URL: http://www.we-online.com
5V-LOW-FUSE = CMP-08605-000053-1: as F-USB on sheet USB-ESP32; Device Class L2: Fuses; Temperature Range High: +125°C; Category: Fuse; ComponentLink2URL: https://www.littelfuse.com/~/media/electronics/datasheets/fuses/littelfuse_fuse_451_453_datasheet.pdf.pdf; Automotive: No; Temperature Range Low: -55°C; Voltage Rating: 125V; ComponentLink2Description: Datasheet; Temperature: -55°C to +125°C; Device Class L3: unset; Height: 2.94mm; Lead Free: Yes; Resistance: 0.0367Ω; Max Fuse Ac Voltage: 125V; Fuse Interrupt Dc Current: 50A; RoHS: TRUE; Fuse Current: 2A; Digikey Description: FUSE BOARD MNT 2A 125VAC/VDC SMD; Device Class L1: Circuit Protection; Octopart: https://octopart.com/0451002.mrl-littelfuse-566376; Mouser Description: Surface Mount Fuses 125V 2A; Package: 0451; Manufacturer Part Number: 0451002.MRL
C35 C37 = CMP-2000-06208-2: CAP ALUM 100UF 20% 50V SMD; Manufacturer Part Number: EEE-FK1H101P; Manufacturer: Panasonic Electronic Components; Automotive Grade: Grade 2; Dissipation Factor: 10%; Life: 2000Hours; Ripple Current: 350mA; Material: Aluminum; Esr: 0.34Ω; Leakage Current: 50uA; Tolerance: 20%; Package: 0; ComponentLink2URL: https://industrial.panasonic.com/cdbs/www-data/pdf/RDE0000/ABA0000C1181.pdf; Temperature Range Low: -55°C; Voltage Rating: 50V; ComponentLink2Description: Datasheet; Category: Cap; Digikey Description: CAP ALUM 100UF 20% 50V SMD; Octopart: https://octopart.com/eeefk1h101p-panasonic-4642841; Automotive: Yes; Temperature: -55°C to +105°C; Capacitance: 100uF; Lead Free: Yes; Mouser Description: Cap Aluminum Lytic 100uF 50V 20% (8 X 10.2mm) SMD 350mA 2000h 105C Automotive T/R; Height: 10.5mm; Device Class L3: Aluminum Electrolytic Capacitors; Value: 100uF; Device Class L1: Passive Components; RoHS: TRUE; Device Class L2: Capacitors; Temperature Range High: +105°C
C36 C38 = CMP-05427-000011-1: CAP ALUM 1000UF 20% 50V SMD; Manufacturer Part Number: EEV-FK1H102M; Manufacturer: Panasonic Electronic Components; Esr: 0.073Ω; Life: 2000Hours; Leakage Current: 500uA; Ripple Current: 1610mA; Dissipation Factor: 10%; Automotive Grade: Grade 2; Material: Aluminum; Capacitance: 1000uF; Tolerance: 20%; Device Class L1: Passive Components; Temperature: -55°C to +105°C; Device Class L2: Capacitors; Mouser Description: Cap Aluminum Lytic 1000uF 50V 20% (16 X 16.5mm) SMD 0.073 Ohm 1610mA 2000h 105C Automotive T/R; Category: Cap; Digikey Description: CAP ALUM 1000UF 20% 50V SMD; Value: 1000uF; Lead Free: Yes; Octopart: https://octopart.com/eev-fk1h102m-panasonic-39480688; Temperature Range High: +105°C; Package: FK-J16; Device Class L3: Aluminum Electrolytic Capacitors; ComponentLink2Description: Datasheet; RoHS: TRUE; Height: 17mm; ComponentLink2URL: https://b2b-api.panasonic.eu/file_stream/pids/fileversion/3127; Voltage Rating: 50V; Temperature Range Low: -55°C; Automotive: Yes
D1 D2 = CMP-12187-000025-1: DIODE SCHOTTKY 40V 3A DO201AD; Manufacturer: STMicroelectronics; Max Junction Temp: +150°C; Peak Reverse Current: 2mA; Max Surge Forward Current: 80A; Temperature Range High: +150°C; Automotive: No; RoHS: TRUE; ComponentLink2Description: Datasheet; Manufacturer Part Number: 1N5822; Lead Free: Yes; Octopart: https://octopart.com/1n5822-stmicroelectronics-323225; Device Class L2: Diodes; Max Repetitive Reverse Voltage: 40V; Temperature: to +150°C; Height: 5.3mm; Category: Diode; Digikey Description: DIODE SCHOTTKY 40V 3A DO201AD; ComponentLink2URL: https://www.st.com/resource/en/datasheet/1n5822.pdf; Device Class L3: Schottky Diodes; Device Class L1: Discrete Semiconductors; Forward Current: 3A; Mouser Description: Schottky Diodes & Rectifiers Vr/40V Io/3A BULK; Package: DO-201AD
GND-FUSE = CMP-2100-03673-1: Chip Resistor, 0 Ohm, Jumper, +/- 5%, 0.125 W, -55 to 155 degC, 0805 (2012 Metric), RoHS, Tape and Reel; Manufacturer: Yageo; Power Rating: 125mW; Resistance: 0mOhm; Voltage Rating (DC): 150V; Temperature Coefficient: 200ppm/degreesC; Height: 0.5mm; Depth: 1.25mm; Case Code (Imperial): 0805; Lead Free: LeadFree; Military Standard: Not; Package Description: 2-Pin Surface Mounted Device, Body 2 x 1.25 mm; Case Code (Metric): 2012; Composition: ThickFilm; Voltage Rating: 150V; Manufacturer URL: http://www.yageo.com/; Packaging: TapeandReel; Package Reference: 0805; REACH SVHC: Unknown; Tolerance: 5%; Case/Package: 0805; Max Operating Temperature: 155degC; Number of Pins: 2; Min Operating Temperature: -55degC; RoHSCompliant: true; Length: 2mm; Datasheet URL: http://www.yageo.com/NewPortal/yageodocoutput?fileName=/pdf/R-Chip/PYu-RC_Group_51_RoHS_L_5.pdf; Termination: SMD/SMT; Radiation Hardening: No; Width: 1.25mm; Contact Plating: Tin; Datasheet Version: Rev. 5, 10/2016
L1#2 L2 = CMP-02424-000256-1: Commercial Inductors, Low DCR Series 100uH 5A 110mΩ 20%; DC Resistance (DCR): 110mR; Saturation Current: 4A; Test Frequency: 100kHz; Core Material: Metal; Self Resonant Frequency: 2.1MHz; Shielding: Shielded; Number of Pins: 2; Termination: SMD/SMT; Case/Package: 6767; Package Quantity: 200; Max Operating Temperature: 125°C; Max DC Current: 4A; Min Operating Temperature: -55°C; Military Standard: Not; Height: 7mm; Tolerance: 20%; Width: 0.675inch; Radiation Hardening: No; Current Rating: 5A; Depth: 17.15mm; RMS Current (Irms): 5A; Mount: Surface Mount; Height - Seated (Max): 0.276inch; Length: 17.15mm; Inductance: 100uH; Inductance Tolerance: 20%; Lead Free: Lead Free; Packaging: Tape and Reel
R39 R40 = CMP-2001-00590-1: as R41 on sheet RELAYS
U7 U8 = CMP-0069-00141-3: SIMPLE SWITCHER® 3A Step-Down Voltage Regulator, 5-pin TO-263; Manufacturer: Texas Instruments; PackageTopMarking: NSUZXYTTE#*LM2576*HVS-5.0 P+; PowerWise: N; RoHS: N; PackageDescription: TO-263, Molded, .400 x .390 x .180in, 5 Lead, .067in Pitch, Surface Mount; Code_JEDEC: MO-169-AB; CompType: Switcher; ComponentLink1URL: http://www.ti.com/general/docs/lit/getliterature.tsp?genericPartNumber=LM2576HV&fileType=pdf; ComponentLink1Description: Datasheet URL; PinCount: 5; PackageReference: KTT0005B

## Sheet CONN.SchDoc
size B
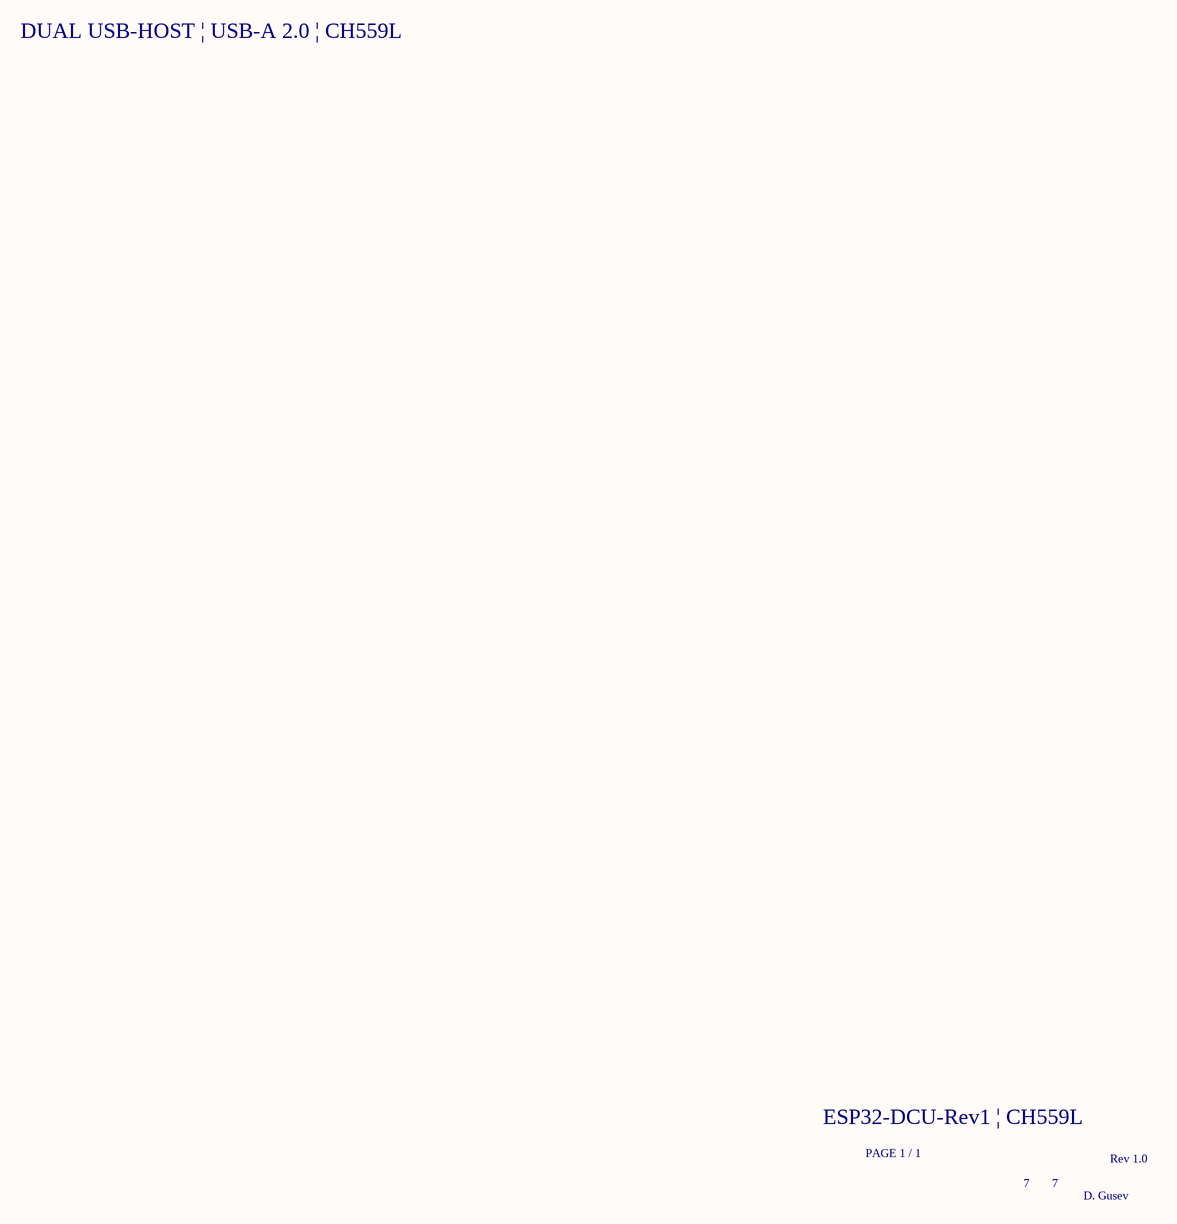
[diagram p9: CONN.SchDoc]

### Notes on the sheet
- DUAL USB-HOST | USB-A 2.0 | CH559L
- ESP32-DCU-Rev1 | CH559L
- PAGE 1 / 1
- 7
- Rev 1.0
- D. Gusev

## Nets that join several sheets
+5V: USB-ESP32 (8 pins), ESP32 (10 pins), MCP23017 (6 pins), TCA9548A (6 pins), POWER (5V-LOW-FUSE.2)
+5V_LOW: USB-HOST (USB-A.1 USB-A.5), POWER (5 pins)
+12: RELAYS (5 pins), POWER (C35.2 U7.1)
GND: ESP32 (8 pins), Ethernet (C17.2)
GND_HV: RELAYS (13 pins), POWER (13 pins)
GND_LV: USB-ESP32 (18 pins), ESP32 (17 pins), USB-HOST (10 pins), Ethernet (30 pins), MCP23017 (5 pins), TCA9548A (5 pins), RELAYS (U10.2 U10.4 U11.2 U11.4), POWER (GND-FUSE.2)
VDD33: USB-ESP32 (6 pins), ESP32 (6 pins), USB-HOST (6 pins), Ethernet (14 pins)
5V-HIGH-ENABLE: RELAYS (R47.2 RELAY1.4 RELAY2.4), POWER (U8.5)
5V-LOW-ENABLE: RELAYS (R55.2 U11.5), POWER (U7.5)
ESP32_RX: USB-ESP32 (U1.20), ESP32 (DEBUG.3 ESP32.34)
ESP32_TX: USB-ESP32 (U1.4), ESP32 (DEBUG.5 ESP32.35)
GPIO0: USB-ESP32 (Q2.3), ESP32 (DEBUG.9 ESP32.25 ESP32-BOOT.2 R13.1)
GPIO16: ESP32 (DEBUG.34 ESP32.27), USB-HOST (U3.37)
GPIO17: ESP32 (DEBUG.36 ESP32.28), USB-HOST (U3.38)
GPIO18 / VSPI_SCK: ESP32 (DEBUG.18 ESP32.30), Ethernet (U4.33 W5500_DEBUG.5)
GPIO19 / VSPI_MISO: ESP32 (DEBUG.14 ESP32.31), Ethernet (U4.34 W5500_DEBUG.4)
GPIO21 / SDA: ESP32 (DEBUG.24 ESP32.33), MCP23017 (U5.12), TCA9548A (U6.22)
GPIO22 / SCL: ESP32 (DEBUG.26 ESP32.36), MCP23017 (U5.13), TCA9548A (U6.23)
GPIO23~{ }/ VSPI_MOSI: ESP32 (DEBUG.16 ESP32.37), Ethernet (U4.35 W5500_DEBUG.3)
GPIO27 / ADC2_CH7: ESP32 (DEBUG.17 ESP32.12), Ethernet (R29.1 U4.37 W5500_DEBUG.7)
RELAY-12V: RELAYS (RELAY1.3 RELAY2.3), POWER (C37.2 U8.1)
RESET: USB-ESP32 (Q1.3), ESP32 (DEBUG.7 ESP32.3 ESP32_RESET.2 R12.1)
SCSn: ESP32 (VSPI-CS-5.2 VSPI-CS-25.2), Ethernet (R28.1 U4.32 W5500_DEBUG.6)